# Altium schematic sheet Soil_EH_Comparator.SchDoc
size A0; SheetNumber: 1; SheetTotal: 1; SPICEModelCacheCFUGDUKS: <root> / <DocumentId>CFUGDUKS</DocumentId> / <CacheFrame Number="0"> / <Model Name="emk107b7105_a-t" Kind="CKT"> / <Text>* EMK107B7105_A-T     SPICE MODEL  ( General Type ) / *-------------------------------------------------------------------------------------------------------- / * Model Generated by TAIYO YUDEN Corporation (http://www.ty-top.com) / * Version 1.0 / * TAIYO YUDEN Control No. 170508_100817 / * Copyright(c) 2012 TAIYO YUDEN CO.,LTD. All Rights Reserved. / *-------------------------------------------------------------------------------------------------------- / * / * Products Name : Multilayer Ceramic Capacitors / * / * Characteristics : / *     Capacitance : 1 uF , Rated Voltage : 16V , TCC : X7R / *     Case Size : 1.6 x 0.8 / 0.063 x 0.031 [mm/inch] , Thickness : 0.8 / 0.031 [mm/inch] / *     (Conditions: Temperature = 25 degC , DC Bias Current/Voltage = 0A / 0V) / * / * Frequency Range : 40Hz - 3GHz / * / * External Node Assignments : / * / *  1  o---| |---o  2 / * / *-------------------------------------------------------------------------------------------------------- / .SubCkt EMK107B7105_A-T 1 2 / **************************** / C0 1 110 0.90108u / Cm 1 101 0.070545u / C1 101 102 0.18914u / Rc1 101 102 4.3021k / C2 102 103 0.067165u / Rc2 102 103 569.84 / C3 103 110 0.028298u / Rc3 103 110 28.506 / C2m 1 301 0.078621u / C21 301 302 0.41782u / Rc21 301 302 10.613k / C22 302 303 0.38277u / Rc22 302 303 9.5065k / C23 303 304 0.47946u / Rc23 303 304 7.4363k / C24 304 305 0.19696u / Rc24 304 305 877.74 / C25 305 306 0.21015u / Rc25 305 306 755.27 / C26 306 307 0.054853u / Rc26 306 307 98.071 / C27 307 308 0.094721u / Rc27 307 308 50.335 / C28 308 309 0.053445u / Rc28 308 309 88.667 / C29 309 110 951.93p / Rc29 309 110 21.6 / Rp0 1 110 100Meg / L0 110 120 0.31208n / Lm 120 130 0.14711n / L1 120 121 0.11343n / RL1 121 130 0.23291 / L2 120 122 0.12254n / RL2 122 130 0.15461 / L3 120 123 0.22819n / RL3 123 130 0.26571 / CR 120 124 0.16707u / LR 124 125 0.23194n / RR 125 130 39.005m / CL 130 140 2.2074p / LL 130 140 0.16837n / RL 130 140 33.851 / Rs 140 2 5.452m / **************************** / .ends EMK107B7105_A-T</Text> / </Model> / </CacheFrame> / </root>
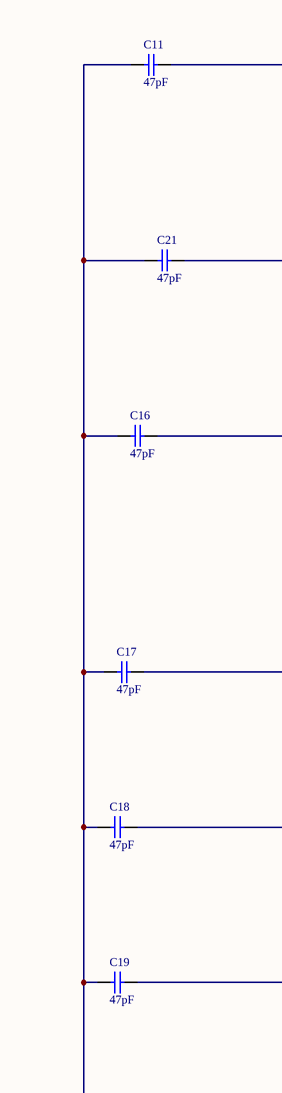
[diagram p0: Soil_EH_Comparator.SchDoc, top left]
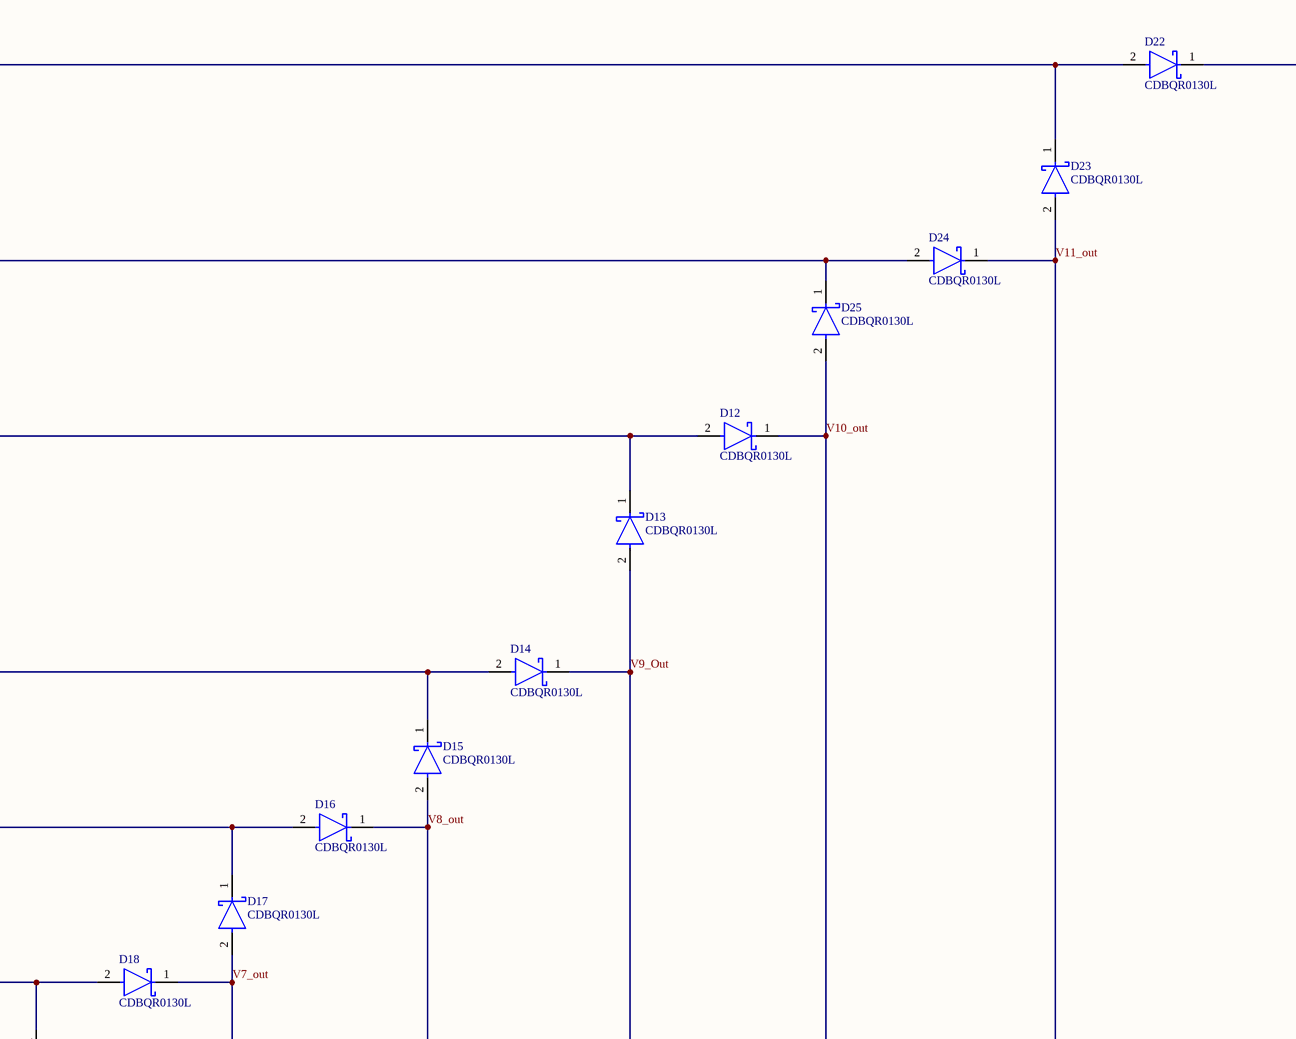
[diagram p1: Soil_EH_Comparator.SchDoc, top middle]
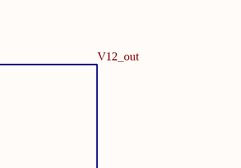
[diagram p2: Soil_EH_Comparator.SchDoc, top right]
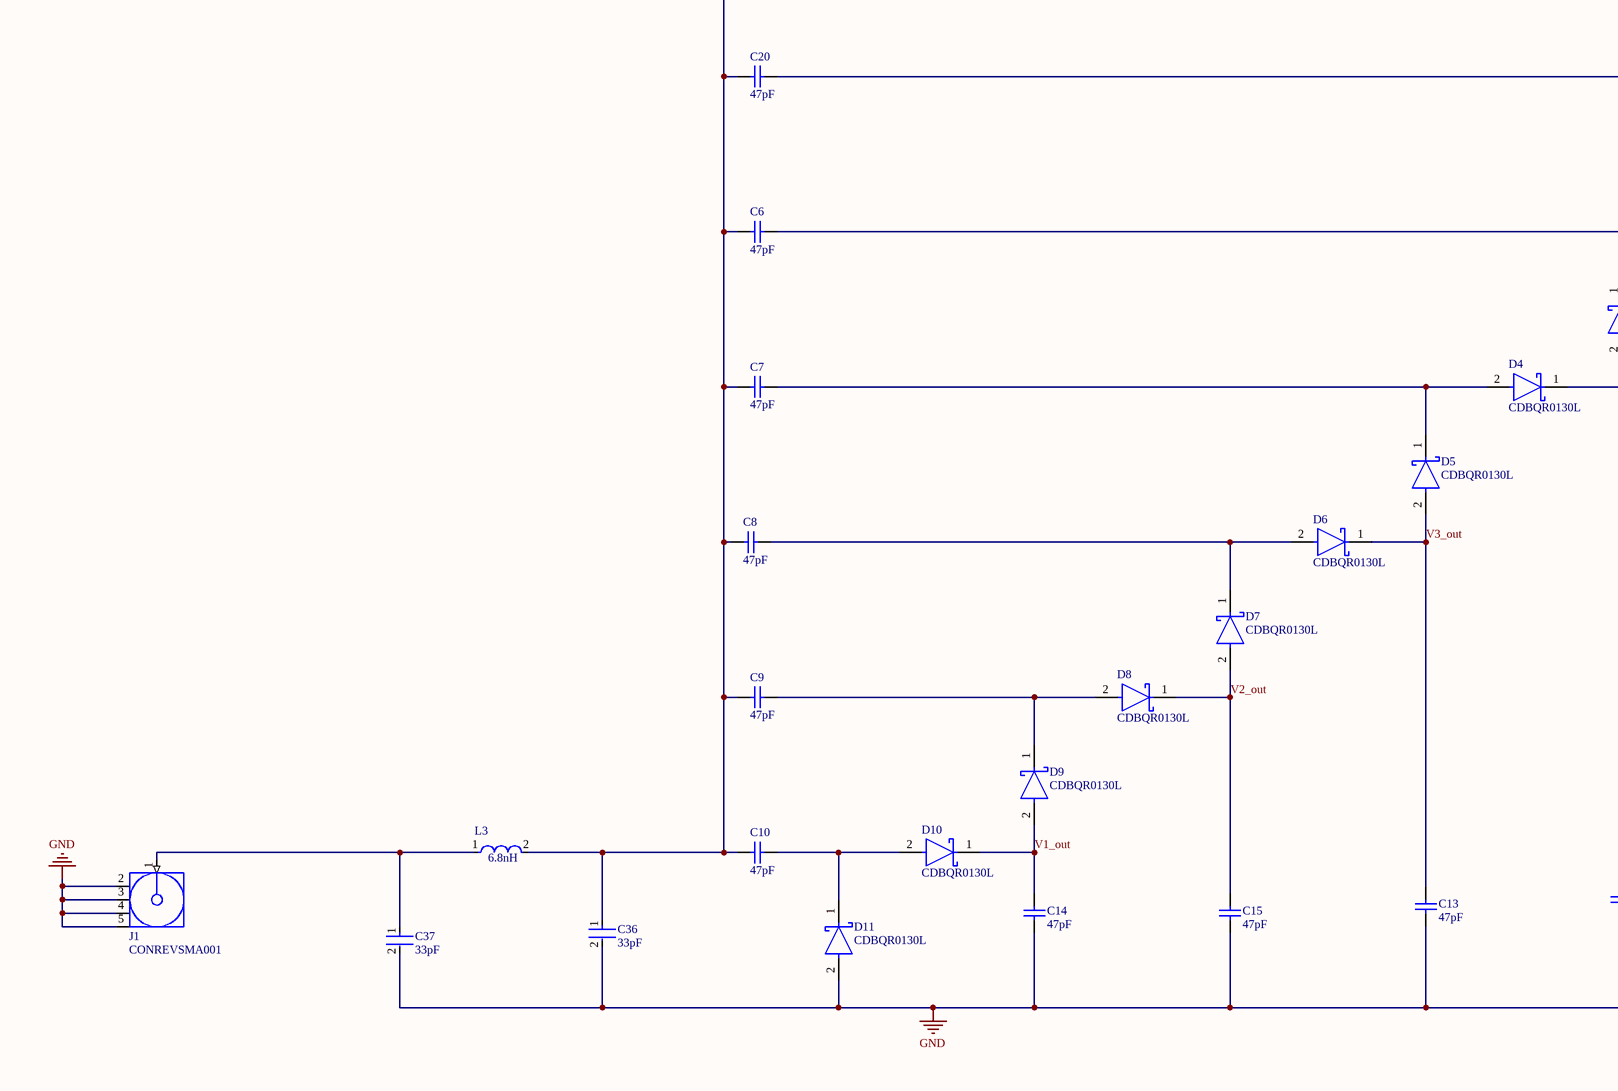
[diagram p3: Soil_EH_Comparator.SchDoc, bottom left]
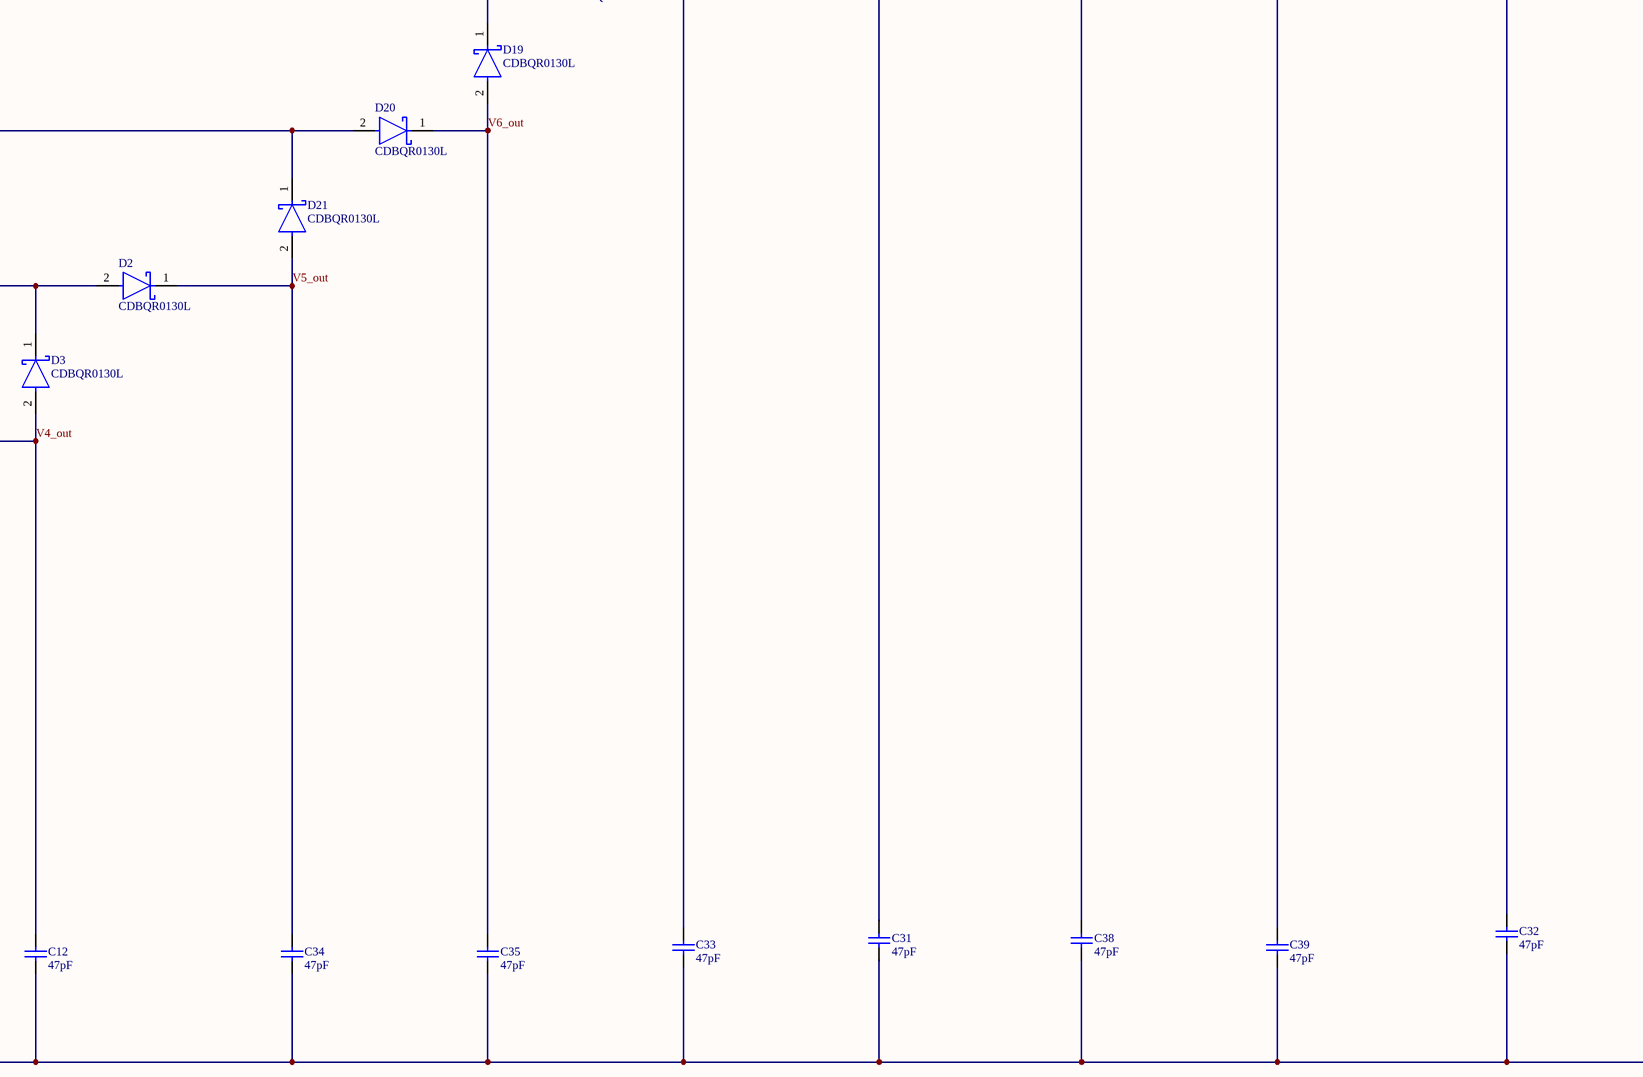
[diagram p4: Soil_EH_Comparator.SchDoc, bottom middle]
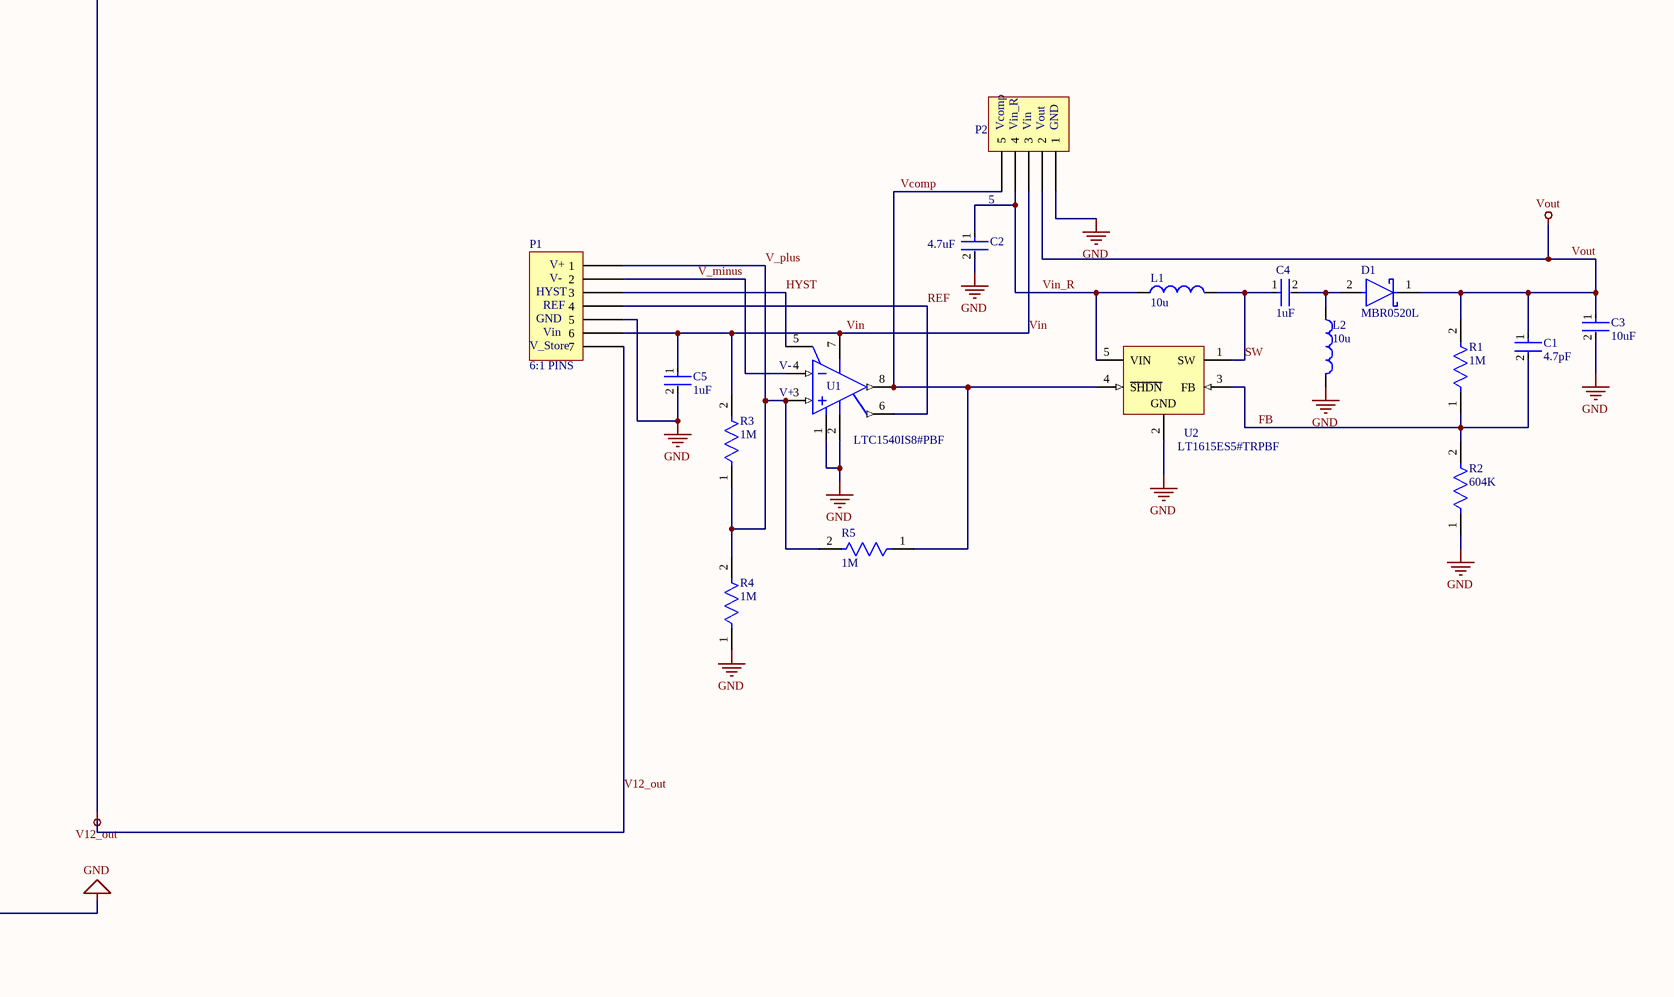
[diagram p5: Soil_EH_Comparator.SchDoc, bottom right]

## Parts
C1  4.7pF  [FP-C0603C-CF-MFG]
C2  4.7uF  [FP-GRM188-0_15-IPC_C]
C3  10uF  [FP-GRM21B-0_1-MFG]
C4  1uF  [FP-0603-L_1_6_0_1-W_0_8_0-IPC_C]
C5  1uF  [FP-0603-L_1_6_0_1-W_0_8_0-IPC_C]
C6  47pF  [CAPC1608X95X40LL15T15]
C7  47pF  [CAPC1608X95X40LL15T15]
C8  47pF  [CAPC1608X95X40LL15T15]
C9  47pF  [CAPC1608X95X40LL15T15]
C10  47pF  [CAPC1608X95X40LL15T15]
C11  47pF  [CAPC1608X95X40LL15T15]
C12  47pF  [CAPC1608X95X40LL15T15]
C13  47pF  [CAPC1608X95X40LL15T15]
C14  47pF  [CAPC1608X95X40LL15T15]
C15  47pF  [CAPC1608X95X40LL15T15]
C16  47pF  [CAPC1608X95X40LL15T15]
C17  47pF  [CAPC1608X95X40LL15T15]
C18  47pF  [CAPC1608X95X40LL15T15]
C19  47pF  [CAPC1608X95X40LL15T15]
C20  47pF  [CAPC1608X95X40LL15T15]
C21  47pF  [CAPC1608X95X40LL15T15]
C31  47pF  [CAPC1608X95X40LL15T15]
C32  47pF  [CAPC1608X95X40LL15T15]
C33  47pF  [CAPC1608X95X40LL15T15]
C34  47pF  [CAPC1608X95X40LL15T15]
C35  47pF  [CAPC1608X95X40LL15T15]
C36  33pF  [FP-C0603C-CF-MFG]
C37  33pF  [FP-C0603C-CF-MFG]
C38  47pF  [CAPC1608X95X40LL15T15]
C39  47pF  [CAPC1608X95X40LL15T15]
D1  MBR0520L  [FP-MA02A-MFG]
D2  CDBQR0130L  [FP-0402-SOD-923F-MFG]
D3  CDBQR0130L  [FP-0402-SOD-923F-MFG]
D4  CDBQR0130L  [FP-0402-SOD-923F-MFG]
D5  CDBQR0130L  [FP-0402-SOD-923F-MFG]
D6  CDBQR0130L  [FP-0402-SOD-923F-MFG]
D7  CDBQR0130L  [FP-0402-SOD-923F-MFG]
D8  CDBQR0130L  [FP-0402-SOD-923F-MFG]
D9  CDBQR0130L  [FP-0402-SOD-923F-MFG]
D10  CDBQR0130L  [FP-0402-SOD-923F-MFG]
D11  CDBQR0130L  [FP-0402-SOD-923F-MFG]
D12  CDBQR0130L  [FP-0402-SOD-923F-MFG]
D13  CDBQR0130L  [FP-0402-SOD-923F-MFG]
D14  CDBQR0130L  [FP-0402-SOD-923F-MFG]
D15  CDBQR0130L  [FP-0402-SOD-923F-MFG]
D16  CDBQR0130L  [FP-0402-SOD-923F-MFG]
D17  CDBQR0130L  [FP-0402-SOD-923F-MFG]
D18  CDBQR0130L  [FP-0402-SOD-923F-MFG]
D19  CDBQR0130L  [FP-0402-SOD-923F-MFG]
D20  CDBQR0130L  [FP-0402-SOD-923F-MFG]
D21  CDBQR0130L  [FP-0402-SOD-923F-MFG]
D22  CDBQR0130L  [FP-0402-SOD-923F-MFG]
D23  CDBQR0130L  [FP-0402-SOD-923F-MFG]
D24  CDBQR0130L  [FP-0402-SOD-923F-MFG]
D25  CDBQR0130L  [FP-0402-SOD-923F-MFG]
J1  CONREVSMA001  [CON-REVSMA]
L1  value 10u  [IND_LQH43CN100K03L]  (hidden comment: Inductor)
L2  value 10u  [IND_LQH43CN100K03L]  (hidden comment: Inductor)
L3  6.8nH  [FP-LQW18AN_00-MFG]
P1  6:1 PINS  [6:1 pins]
P2  5  [5]
R1  1M  [FP-ERJ3EK-IPC_C]
R2  604K  [FP-RMCF0603-IPC_B]
R3  1M  [FP-ERJ3EK-IPC_C]
R4  1M  [FP-ERJ3EK-IPC_C]
R5  1M  [FP-ERJ3EK-IPC_C]
U1  LTC1540IS8#PBF  [LT-S8_L]
U2  LT1615ES5#TRPBF  [LT-S5-5-TSOT-23_N]

## Nets
GND: C2.2 C3.2 C5.2 C12.1 C13.1 C14.1 C15.1 C31.1 C32.1 C33.1 C34.1 C35.1 C36.2 C37.2 C38.1 C39.1 D11.2(A) J1.2(GND) J1.3(GND) J1.4(GND) J1.5(GND) L2.2 P1.5 P2.1 R2.1 R4.1 U1.1(GND) U1.2(V-) U2.2(GND)
V12_out: D22.1(C) P1.7
Vout: C1.1 C3.1 D1.1(C) P2.2 R1.2
FB: C1.2 R1.1 R2.2 U2.3(FB)
HYST: P1.3 U1.5(HYST)
REF: P1.4 U1.6(REF)
SW: C4.1 L1.2 U2.1(SW)
V1_out: C14.2 D9.2(A) D10.1(C)
V2_out: C15.2 D7.2(A) D8.1(C)
V3_out: C13.2 D5.2(A) D6.1(C)
V4_out: C12.2 D3.2(A) D4.1(C)
V5_out: C34.2 D2.1(C) D21.2(A)
V6_out: C35.2 D19.2(A) D20.1(C)
V7_out: C33.2 D17.2(A) D18.1(C)
V8_out: C31.2 D15.2(A) D16.1(C)
V9_Out: C38.2 D13.2(A) D14.1(C)
V10_out: C39.2 D12.1(C) D25.2(A)
V11_out: C32.2 D23.2(A) D24.1(C)
V_minus: P1.2 U1.4(IN-)
V_plus: P1.1 R3.1 R4.2 R5.2 U1.3(IN+)
Vcomp: P2.5 R5.1 U1.8(OUT) U2.4(~{SHDN})
Vin: C5.1 P1.6 P2.3 R3.2 U1.7(V+)
Vin_R: C2.1 L1.1 P2.4 U2.5(VIN)
NetC4_2: C4.2 D1.2(A) L2.1
NetC6_1: C6.1 C7.1 C8.1 C9.1 C10.1 C11.1 C16.1 C17.1 C18.1 C19.1 C20.1 C21.1 C36.1 L3.2
NetC6_2: C6.2 D2.2(A) D3.1(C)
NetC7_2: C7.2 D4.2(A) D5.1(C)
NetC8_2: C8.2 D6.2(A) D7.1(C)
NetC9_2: C9.2 D8.2(A) D9.1(C)
NetC10_2: C10.2 D10.2(A) D11.1(C)
NetC11_2: C11.2 D22.2(A) D23.1(C)
NetC16_2: C16.2 D12.2(A) D13.1(C)
NetC17_2: C17.2 D14.2(A) D15.1(C)
NetC18_2: C18.2 D16.2(A) D17.1(C)
NetC19_2: C19.2 D18.2(A) D19.1(C)
NetC20_2: C20.2 D20.2(A) D21.1(C)
NetC21_2: C21.2 D24.2(A) D25.1(C)
NetC37_1: C37.1 J1.1(Signal) L3.1

## Notes on the sheet
- (near P2) Vcomp
- (near P2) Vin_R
- (near P2) Vin
- (near P2) Vout
- (near P2) GND
- (near P1) V+
- (near P1) V-
- (near P1) V_Store
- (near P1) HYST
- (near P1) GND
- (near P1) REF
- (near P1) Vin
- (near U1) V-
- (near U1) V+

## Library data of the parts
C1 = CMP-03020-018749-1: CAP CER 4.7PF 25V C0G/NP0 0603; Manufacturer Part Number: C0603C479C3GACAUTO; Manufacturer: KEMET; Automotive Grade: Grade 1; Temperature Characteristic: C0G; Temperature Coefficient: 30ppm/°C; Material: Ceramic; Tolerance: 0.25 pF; Digikey Description: CAP CER 4.7PF 25V C0G/NP0 0603; Value: 4.7 pF; Octopart: https://octopart.com/c0603c479c3gacauto-kemet-21768564; Temperature Range High: +125°C; Device Class L2: Capacitors; Device Class L3: Ceramic Capacitors; Temperature: -55°C to +125°C; Category: Cap; Voltage Rating: 25 V; RoHS: TRUE; Package: C0603C-CF; Temperature Range Low: -55°C; Automotive: Yes; ComponentLink2Description: Datasheet; ComponentLink2URL: https://api.kemet.com/component-edge/download/datasheet/C0603C100J5GACAUTO.pdf; Lead Free: Yes; Height: 0.87mm; Device Class L1: Passive Components; Capacitance: 4.7 pF
C2 = CMP-2006-02523-2: Chip Multilayer Ceramic Capacitors for General Purpose, 0603, 4.7uF, X5R, 15%, 10%, 25V; Case Code (Metric): 1608; Max Operating Temperature: 85°C; REACH SVHC: No SVHC; Voltage Rating: 25V; Dielectric: X5R; Packaging: Cut Tape; Width: 0.031inch; Min Operating Temperature: -55°C; Lead Free: Lead Free; Capacitance: 4.7uF; Height: 0.8mm; Case Code (Imperial): 0603; Length: 1.6mm; Voltage Rating (DC): 25V; Case/Package: 0603; Voltage: 25V; Tolerance: 10%; Thickness: 0.031inch; Mount: Surface Mount; Material: Ceramic; Package Quantity: 4000; Depth: 0.8mm
C3 = CMP-2007-03534-2: Chip Multilayer Ceramic Capacitors for General Purpose, 0805, 10uF, X5R, 15%, 10%, 16V; Case Code (Imperial): 0805; Packaging: Tape and Reel; Width: 0.049inch; Depth: 1.25mm; Voltage Rating: 16V; Height: 1.25mm; Case/Package: 0805; Max Operating Temperature: 85°C; Min Operating Temperature: -55°C; Tolerance: 10%; Dielectric: X5R; REACH SVHC: No SVHC; Mount: Surface Mount; Radiation Hardening: No; Case Code (Metric): 2012; Length: 2mm; Package Quantity: 10000; Voltage Rating (DC): 16V; Voltage: 16V; Capacitance: 10uF; Thickness: 0.053inch; Termination: SMD/SMT
C4 C5 = CMP-14477-000018-3: None; Voltage Rating (DC): 16V; Dielectric: X7R; Tolerance: 10%; Halogen Free: Halogen Free; Height: 0.8mm; REACH SVHC: No SVHC; Contact Plating: Nickel; Number of Pins: 2; Resistor Type: Ceramic; Series: M; Thickness: 0.035inch; Construction: Flat; Voltage Rating: 16V; Capacitance: 1uF; Packaging: Tape and Reel; Width: 0.031inch; Length: 1.6mm; Case Code (Metric): 1608; RoHS Compliant: Yes; Termination: SMD/SMT; Min Operating Temperature: -55°C; Case/Package: 0603; Mount: Surface Mount; Case Code (Imperial): 0603; Depth: 0.8mm; Package Quantity: 1; Max Operating Temperature: 125°C; Lead Free: Lead Free; Radiation Hardening: No
C6-C21 C31-C35 C38 C39 = CMP-2006-01548-1: Part Number: VJ0603A470FXACW1BC; Manufacturer: Vitramon
C36 C37 = CMP-2006-03463-2: CAP CER 33PF 50V 1% NP0 0603; Manufacturer Part Number: C0603C330F5GACTU; Manufacturer: KEMET; Automotive Grade: Grade 1; Material: Ceramic; Temperature Coefficient: 30ppm/°C; Tolerance: 0.01; Temperature Characteristic: C0G; Device Class L1: Passive Components; Height: 0.87mm; Lead Free: Yes; Package: C0603C-CF; Temperature: -55°C to +125°C; Mouser Description: Multilayer Ceramic Capacitors MLCC - SMD/SMT 50volts 33pF C0G 1%; Octopart: https://octopart.com/c0603c330f5gactu-kemet-9143758; Device Class L2: Capacitors; Digikey Description: CAP CER 33PF 50V 1% NP0 0603; ComponentLink2Description: Datasheet; Category: Cap; ComponentLink2URL: https://api.kemet.com/component-edge/download/datasheet/C0603C100J5GACAUTO.pdf; Value: 33 pF; RoHS: TRUE; Voltage Rating: 50 V; Automotive: Yes; Temperature Range Low: -55°C; Device Class L3: Ceramic Capacitors; Capacitance: 33 pF; Temperature Range High: +125°C
D1 = CMP-2000-04926-2: DIODE SCHOTTKY 20V 500MA SOD123; Current Rating: 500A; Peak Non-Repetitive Surge Current: 5.5A; Peak Reverse Current: 250uA; Power Dissipation: 400mW; Polarity: Standard; Element Configuration: Single; Capacitance: 4pF; Forward Voltage: 385mV; Voltage Rating (DC): 20V; Max Reverse Voltage (DC): 20V; Packaging: Tape and Reel; Min Operating Temperature: -65°C; Max Repetitive Reverse Voltage (Vrrm): 20V; Forward Current: 500mA; Max Operating Temperature: 125°C; Width: 1.6mm; Height: 1.03mm; Max Forward Surge Current (Ifsm): 5.5A; Mount: Surface Mount; Max Reverse Leakage Current: 250uA; Weight: 0.03g; Package Quantity: 3000; Max Surge Current: 5.5A; Radiation Hardening: No; REACH SVHC: No SVHC; Average Rectified Current: 500mA; Output Current: 500mA; Length: 2.7mm; Number of Pins: 2; Lead Free: Lead Free
D2-D25 = CMP-20227-000005-1: DIODE SCHOTTKY 30V 100MA 0402; Max Surge Current: 1A; Max Reverse Leakage Current: 10uA; Packaging: Tape and Reel; Case Code (Imperial): 0402; Package Quantity: 1; Case Code (Metric): 1005; Max Reverse Voltage (DC): 30V; Mount: Surface Mount; Average Rectified Current: 100mA; Case/Package: 0402
J1 = CMP-0168-00008-1: RP-SMA Female PCB Mount Connector, Thru-Hole; DatasheetVersion: rev1.0, Mar-2005; PackageVersion: rev1.0, Mar-2005; PackageDescription: RP-SMA Female PCB Mount Connector, Thru-Hole, 7 x 7 mm Body; PackageReference: CON-REVSMA
L1 L2 = Inductor: SimulationGenericComponent: True
L3 = CMP-06042-000801-1: Wire Wound RF Inductor 6.8nH ±0.5nH 750mA 0.082Ω 0603 (1608); Q Factor: 35; DC Resistance (DCR): 82mR; Self Resonant Frequency: 6GHz; Shielding: Unshielded; Core Material: Non-Magnetic; Test Frequency: 100MHz; Depth: 1mm; Military Standard: Not; Mount: Surface Mount; Case Code (Imperial): 0603; Package Quantity: 4000; Case/Package: 0603; Height - Seated (Max): 0.039inch; Min Operating Temperature: -55°C; Case Code (Metric): 1608; Termination: SMD/SMT; Resistor Type: Wirewound; DC Current: 750mA; Radiation Hardening: No; Inductance: 6.8nH; Max Operating Temperature: 125°C; Packaging: Tape and Reel; Series Resistance: 82mR; Height: 0.8mm; Current Rating: 750mA; Max DC Current: 750mA; Width: 0.031inch; Lead Free: Lead Free; Length: 1.6mm; Weight: 0.000106oz
R1 R3-R5 = CMP-1012-00849-3: RES SMD 1M OHM 1% 1/10W 0603; Resistance: 1MR; Voltage Rating: 75V; Temperature Coefficient: 100ppm/°C; Power Rating: 100mW; REACH SVHC: No SVHC; Radiation Hardening: No; Features: Automotive AEC-Q200; Case Code (Metric): 1608; Resistance Tolerance: 1%; Case/Package: 0603; Termination: SMD/SMT; Max Operating Temperature: 155°C; Tolerance: 1%; Size Code: 0603; Case Code (Imperial): 0603; Min Operating Temperature: -55°C; Number of Pins: 2; Mount: Surface Mount; Package Quantity: 1; Military Standard: Not; Voltage Rating (DC): 75V; Depth: 0.8mm; Packaging: Tape and Reel; Width: 0.8mm; Number of Terminations: 2; Length: 1.6mm; Height: 0.022inch; RoHS Compliant: Yes; Resistor Type: Thick Film; Contact Plating: Tin; Lead Free: Lead Free; Series: ERJ; Construction: Rectangular; Max Power Dissipation: 100mW
R2 = CMP-26527-005269-1: 604kΩ ±1% 0.1W 0603 Thick Film Chip Resistor AEC-Q200 compliant; Resistance: 604kR; Max Power Dissipation: 100mW; Temperature Coefficient: 100ppm/°C; Features: Automotive AEC-Q200; Series: RMCF; Case/Package: 0603; Case Code (Imperial): 0603; Length: 0.061inch; Contact Plating: Tin; Military Standard: Not; Number of Terminations: 2; Width: 0.031inch; Package Quantity: 5000; Packaging: Tape and Reel; Tolerance: 1%; Height: 0.022inch; Construction: Rectangular; Max Operating Temperature: 155°C; Mount: Surface Mount; Lead Free: Lead Free; Radiation Hardening: No; Resistor Type: Thick Film; RoHS Compliant: Yes; Depth: 0.8mm; Min Operating Temperature: -55°C; Case Code (Metric): 1608
U1 = CMP-0360-00613-3: Nanopower Comparator with Reference, 1 Channel, 2 to 11 V, -40 to +85 degC, 8-pin SOP (S8); Manufacturer: Linear Technology; Prop Delay (us): 50; Vs Min (V): 2; Supply Voltage Range: 2 to 11 V; Channels (#): 1; Vos (mV) Typical: 12; Vs Max (V): 11; Supply Current (uA) Typical: 0.3; Supply Current (uA) Guaranteed: 0.68; ComponentLink2URL: http://cds.linear.com/docs/en/datasheet/1540fas.pdf; PartNumber: LTC1540IS8#PBF; ComponentLink1Description: Manufacturer URL; Features: Reference, Comparator; RoHS: Y; Generic Part Number: LTC1540; DatasheetVersion: Rev A; PackageReference: S8; ComponentLink3Description: Package Specification; Mounting Technology: Surface Mount; ComponentLink3URL: http://cds.linear.com/docs/en/packaging/05081610_G_SO8.pdf; ComponentLink2Description: Datasheet; ComponentLink1URL: http://www.linear.com/; PackageDescription: 8-Pin Plastic Small Outline (Narrow .150 Inch), Body 4.9 x 3.9 mm, Pitch 1.27 mm; Vos (mV) Guaranteed: 12
U2 = CMP-0491-01542-1: Micropower Step-Up DC/DC Converter, 5-pin SOT23 (S5-5), -40 to 85 degC, Pb-Free, Tape and Reel; Manufacturer: Linear Technology; Number of Outputs: 1; PackageDescription: 5-Pin Plastic TSOT-23, Body 1.63 x 2.90 mm, Pitch 0.95 mm; ComponentLink1URL: http://www.linear.com/; Packing: Tape and Reel; Mounting Technology: Surface Mount; ComponentLink3Description: Package Specification; Code_JEDEC: MO-193; RoHS: TRUE; ComponentLink2URL: http://cds.linear.com/docs/en/datasheet/16151fas.pdf; PackageVersion: Jun-10; ComponentLink2Description: Datasheet; PartNumber: LT1615ES5#TRPBF; PackageReference: S5-5; ComponentLink1Description: Manufacturer URL; ComponentLink3URL: http://cds.linear.com/docs/en/packaging/SOT_5_05-08-1635.pdf